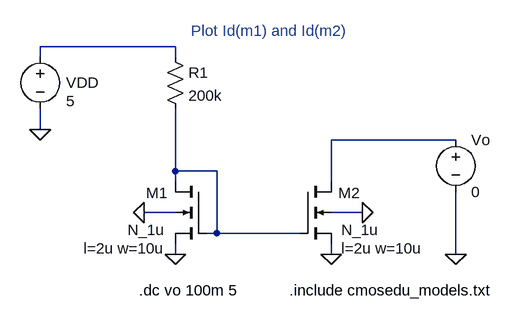
[diagram p0: schematic Fig20_4.asc]
Fig20_4.asc, the LTspice schematic file:
Version 4
SHEET 1 1136 680
WIRE 448 -96 240 -96
WIRE 240 -80 240 -96
WIRE 448 -80 448 -96
WIRE 240 32 240 0
WIRE 880 48 688 48
WIRE 448 96 448 0
WIRE 512 96 448 96
WIRE 448 112 448 96
WIRE 688 112 688 48
WIRE 448 160 400 160
WIRE 736 160 688 160
WIRE 512 192 512 96
WIRE 512 192 496 192
WIRE 640 192 512 192
WIRE 448 224 448 208
WIRE 688 224 688 208
WIRE 880 224 880 128
FLAG 688 224 0
FLAG 240 32 0
FLAG 736 160 0
FLAG 448 224 0
FLAG 400 160 0
FLAG 880 224 0
SYMBOL nmos4 640 112 R0
WINDOW 0 59 18 Left 0
WINDOW 3 64 75 Left 0
WINDOW 123 64 103 Left 0
SYMATTR InstName M2
SYMATTR Value N_1u
SYMATTR Value2 l=2u w=10u
SYMBOL voltage 240 -96 R0
WINDOW 0 40 56 Left 0
WINDOW 3 40 84 Left 0
WINDOW 123 0 0 Left 0
WINDOW 39 0 0 Left 0
SYMATTR InstName VDD
SYMATTR Value 5
SYMBOL nmos4 496 112 M0
WINDOW 0 59 18 Left 0
WINDOW 3 64 75 Left 0
WINDOW 123 64 103 Left 0
SYMATTR InstName M1
SYMATTR Value N_1u
SYMATTR Value2 l=2u w=10u
SYMBOL res 432 -96 R0
SYMATTR InstName R1
SYMATTR Value 200k
SYMBOL voltage 880 32 R0
WINDOW 123 0 0 Left 0
WINDOW 39 0 0 Left 0
SYMATTR InstName Vo
SYMATTR Value 0
TEXT 392 280 Left 0 !.dc vo 100m 5 
TEXT 624 280 Left 0 !.include cmosedu_models.txt
TEXT 472 -120 Left 0 ;Plot Id(m1) and Id(m2)

The netlist it stands for:
* Fig20_4.asc
M2 N002 N003 0 0 N_1u l=2u w=10u
VDD N001 0 5
M1 N003 N003 0 0 N_1u l=2u w=10u
R1 N001 N003 200k
Vo N002 0 0
.model NMOS NMOS
.model PMOS PMOS
.lib standard.mos
.dc vo 100m 5
.include cmosedu_models.txt
* Plot Id(m1) and Id(m2)
.backanno
.end